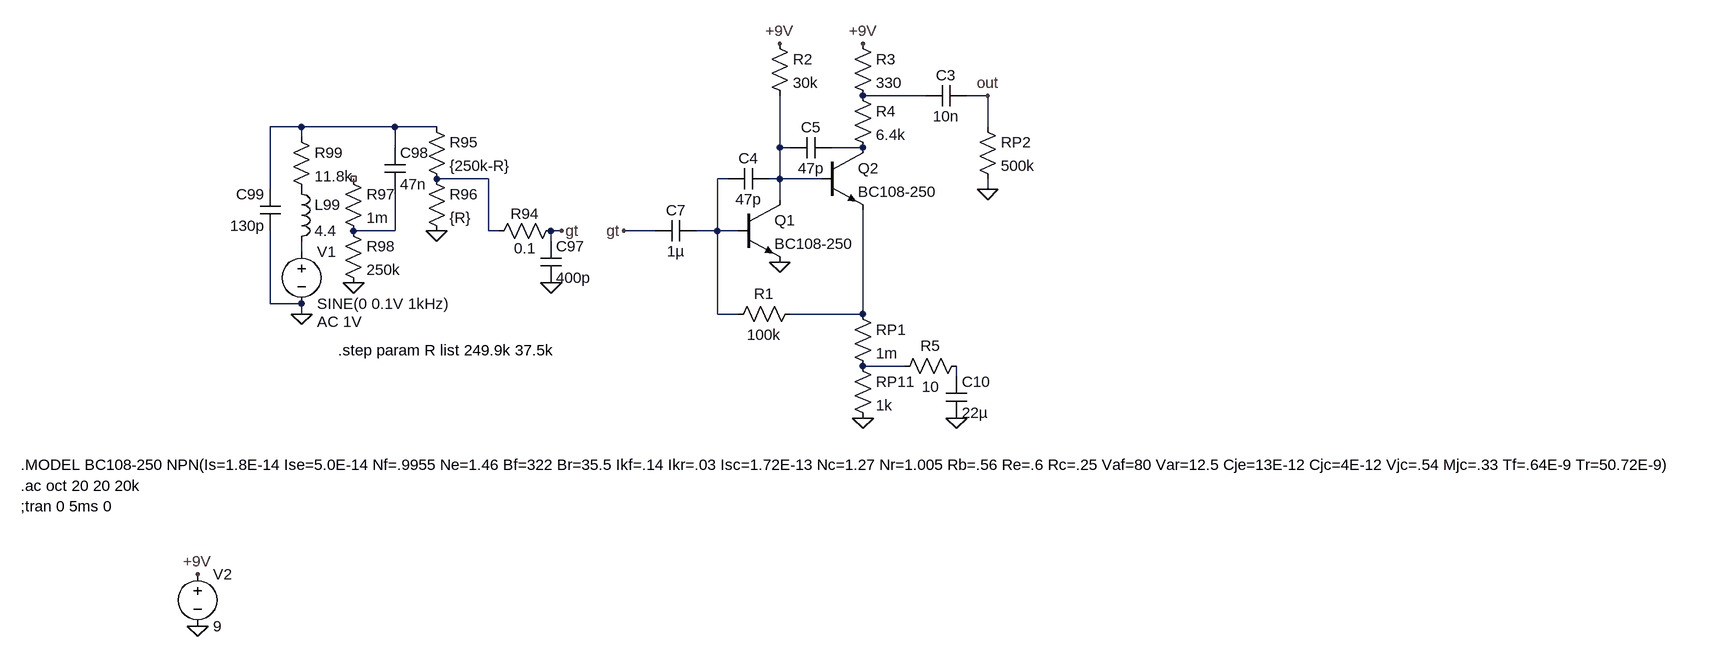
[diagram p0: schematic ffm1.asc]
ffm1.asc, the LTspice schematic file:
Version 4
SHEET 1 3624 2312
WIRE -816 736 -912 736
WIRE -720 736 -752 736
WIRE -1776 784 -1824 784
WIRE -1632 784 -1776 784
WIRE -1568 784 -1632 784
WIRE -720 784 -720 736
WIRE -1776 800 -1776 784
WIRE -1632 816 -1632 784
WIRE -1040 816 -1040 736
WIRE -1024 816 -1040 816
WIRE -912 816 -960 816
WIRE -1488 864 -1568 864
WIRE -1120 864 -1136 864
WIRE -1040 864 -1040 816
WIRE -1040 864 -1056 864
WIRE -976 864 -1040 864
WIRE -1824 880 -1824 784
WIRE -720 880 -720 864
WIRE -1040 896 -1040 864
WIRE -1632 944 -1632 880
WIRE -1632 944 -1696 944
WIRE -1488 944 -1488 864
WIRE -1472 944 -1488 944
WIRE -1376 944 -1392 944
WIRE -1232 944 -1280 944
WIRE -1136 944 -1136 864
WIRE -1136 944 -1168 944
WIRE -1104 944 -1136 944
WIRE -1392 960 -1392 944
WIRE -1776 976 -1776 960
WIRE -1824 1056 -1824 944
WIRE -1776 1056 -1824 1056
WIRE -1776 1072 -1776 1056
WIRE -1136 1072 -1136 944
WIRE -1104 1072 -1136 1072
WIRE -912 1072 -912 912
WIRE -912 1072 -1024 1072
WIRE -848 1152 -912 1152
WIRE -768 1168 -768 1152
FLAG -720 880 0
FLAG -720 736 out
FLAG -1040 992 0
FLAG -912 1232 0
FLAG -768 1232 0
FLAG -1936 1472 +9V
FLAG -1936 1552 0
FLAG -1040 656 +9V
FLAG -912 656 +9V
FLAG -1776 1072 0
FLAG -1568 944 0
FLAG -1696 1024 0
FLAG -1392 1024 0
FLAG -1376 944 gt
FLAG -1280 944 gt
SYMBOL res -928 640 R0
SYMATTR InstName R3
SYMATTR Value 330
SYMBOL cap -752 720 R90
WINDOW 0 0 32 VBottom 2
WINDOW 3 32 32 VTop 2
SYMATTR InstName C3
SYMATTR Value 10n
SYMBOL res -736 768 R0
SYMATTR InstName RP2
SYMATTR Value 500k
SYMBOL res -1056 640 R0
SYMATTR InstName R2
SYMATTR Value 30k
SYMBOL res -928 720 R0
SYMATTR InstName R4
SYMATTR Value 6.4k
SYMBOL res -1008 1056 R90
WINDOW 0 0 56 VBottom 2
WINDOW 3 32 56 VTop 2
SYMATTR InstName R1
SYMATTR Value 100k
SYMBOL res -928 1056 R0
SYMATTR InstName RP1
SYMATTR Value 1m
SYMBOL res -928 1136 R0
SYMATTR InstName RP11
SYMATTR Value 1k
SYMBOL cap -784 1232 M180
WINDOW 0 24 56 Left 2
WINDOW 3 24 8 Left 2
SYMATTR InstName C10
SYMATTR Value 22µ
SYMBOL voltage -1936 1456 R0
SYMATTR InstName V2
SYMATTR Value 9
SYMBOL npn -976 816 R0
SYMATTR InstName Q2
SYMATTR Value BC108-250
SYMBOL npn -1104 896 R0
SYMATTR InstName Q1
SYMATTR Value BC108-250
SYMBOL cap -1168 928 R90
WINDOW 0 0 32 VBottom 2
WINDOW 3 32 32 VTop 2
SYMATTR InstName C7
SYMATTR Value 1µ
SYMBOL res -752 1136 R90
WINDOW 0 0 56 VBottom 2
WINDOW 3 32 56 VTop 2
SYMATTR InstName R5
SYMATTR Value 10
SYMBOL cap -1808 944 R180
WINDOW 0 24 56 Left 2
WINDOW 3 24 8 Left 2
SYMATTR InstName C99
SYMATTR Value 130p
SYMBOL voltage -1776 960 R0
WINDOW 123 24 124 Left 2
WINDOW 39 0 0 Left 2
SYMATTR Value2 AC 1V
SYMATTR InstName V1
SYMATTR Value SINE(0 0.1V 1kHz)
SYMBOL res -1792 784 R0
SYMATTR InstName R99
SYMATTR Value 11.8k
SYMBOL ind -1792 864 R0
SYMATTR InstName L99
SYMATTR Value 4.4
SYMBOL cap -1648 816 R0
SYMATTR InstName C98
SYMATTR Value 47n
SYMBOL res -1584 768 R0
SYMATTR InstName R95
SYMATTR Value {250k-R}
SYMBOL res -1584 848 R0
SYMATTR InstName R96
SYMATTR Value {R}
SYMBOL res -1712 848 R0
SYMATTR InstName R97
SYMATTR Value 1m
SYMBOL res -1712 928 R0
SYMATTR InstName R98
SYMATTR Value 250k
SYMBOL cap -1408 960 R0
SYMATTR InstName C97
SYMATTR Value 400p
SYMBOL res -1376 928 R90
WINDOW 0 5 56 VBottom 2
WINDOW 3 27 56 VTop 2
SYMATTR InstName R94
SYMATTR Value 0.1
SYMBOL cap -960 800 R90
WINDOW 0 0 32 VBottom 2
WINDOW 3 32 32 VTop 2
SYMATTR InstName C5
SYMATTR Value 47p
SYMBOL cap -1056 848 R90
WINDOW 0 0 32 VBottom 2
WINDOW 3 32 32 VTop 2
SYMATTR InstName C4
SYMATTR Value 47p
TEXT -2208 1336 Left 2 !.ac oct 20 20 20k
TEXT -2208 1368 Left 2 !;tran 0 5ms 0
TEXT -1720 1128 Left 2 !.step param R list 249.9k 37.5k
TEXT -2208 1304 Left 2 !.MODEL BC108-250 NPN(Is=1.8E-14 Ise=5.0E-14 Nf=.9955 Ne=1.46 Bf=322 Br=35.5 Ikf=.14 Ikr=.03 Isc=1.72E-13 Nc=1.27 Nr=1.005 Rb=.56 Re=.6 Rc=.25 Vaf=80 Var=12.5 Cje=13E-12 Cjc=4E-12 Vjc=.54 Mjc=.33 Tf=.64E-9 Tr=50.72E-9)

The netlist it stands for:
* ffm1.asc
R3 +9V N001 330
C3 out N001 10n
RP2 out 0 500k
R2 +9V N003 30k
R4 N001 N004 6.4k
R1 N009 N006 100k
RP1 N009 N010 1m
RP11 N010 0 1k
C10 0 N011 22µ
V2 +9V 0 9
Q2 N004 N003 N009 0 BC108-250
Q1 N003 N006 0 0 BC108-250
C7 N006 gt 1µ
R5 N011 N010 10
C99 0 N002 130p
V1 N008 0 SINE(0 0.1V 1kHz) AC 1V
R99 N002 P001 11.8k
L99 P001 N008 4.4
C98 N002 N007 47n
R95 N002 N005 {250k-R}
R96 N005 0 {R}
R97 NC_01 N007 1m
R98 N007 0 250k
C97 gt 0 400p
R94 gt N005 0.1
C5 N004 N003 47p
C4 N003 N006 47p
.model NPN NPN
.model PNP PNP
.lib standard.bjt
.ac oct 20 20 20k
;tran 0 5ms 0
.step param R list 249.9k 37.5k
.MODEL BC108-250 NPN(Is=1.8E-14 Ise=5.0E-14 Nf=.9955 Ne=1.46 Bf=322 Br=35.5 Ikf=.14 Ikr=.03 Isc=1.72E-13 Nc=1.27 Nr=1.005 Rb=.56 Re=.6 Rc=.25 Vaf=80 Var=12.5 Cje=13E-12 Cjc=4E-12 Vjc=.54 Mjc=.33 Tf=.64E-9 Tr=50.72E-9)
.backanno
.end